# Altium schematic sheet TPS5530RTE_Schematic.SchDoc
size A
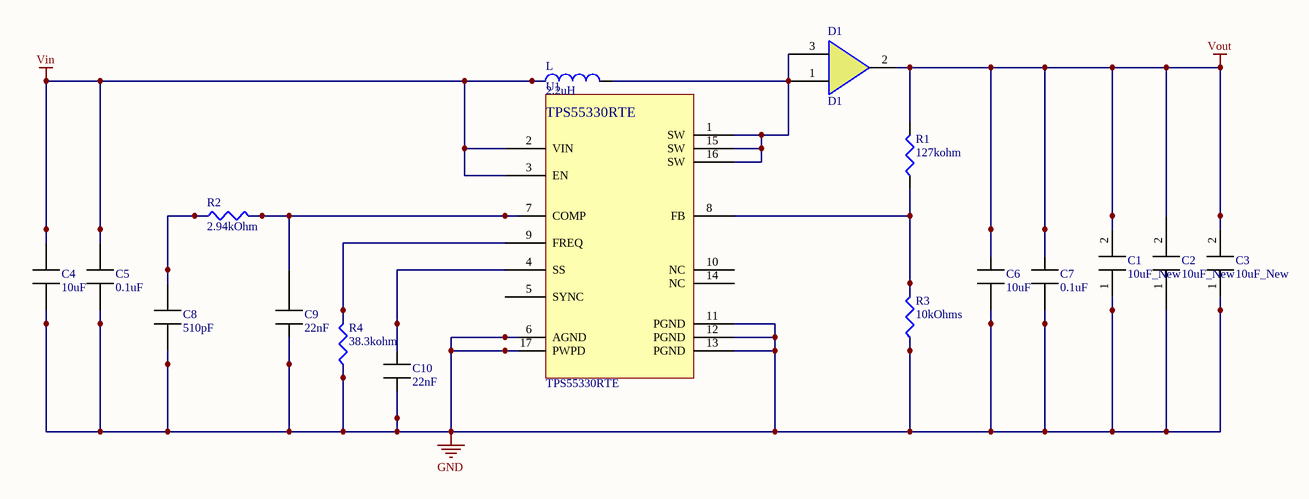
[diagram p0: TPS5530RTE_Schematic.SchDoc]

## Parts
C1  10uF_New  [CAPPM7343X310N]
C2  10uF_New  [CAPPM7343X310N]
C3  10uF_New  [CAPPM7343X310N]
C4  10uF  [C/R1206]
C5  0.1uF  [C/R0402]
C6  10uF  [C/R0805]
C7  0.1uF  [C/R0402]
C8  510pF  [C/R0402]
C9  22nF  [C/R0805]
C10  22nF  [C/R0805]
D1  D1  [D1]
L  2.2uH  [L1]
R1  127kohm  [C/R0805]
R2  2.94kOhm  [C/R0805]
R3  10kOhms  [C/R0805]
R4  38.3kohm  [C/R0805]
U1  TPS55330RTE  [TPS55330]

## Nets
GND: C1.1 C2.1 C3.1 C4.2 C5.2 C6.2 C7.1 C8.2 C9.1 C10.1 R3.1 R4.1 U1.6(AGND) U1.11(PGND) U1.12(PGND) U1.13(PGND) U1.17(PWPD)
Vin: C4.1 C5.1 L.1 U1.2(VIN) U1.3(EN)
Vout: C1.2 C2.2 C3.2 C6.1 C7.2 D1.2 R1.2
NetC8_1: C8.1 R2.1
NetC9_2: C9.2 R2.2 U1.7(COMP)
NetC10_2: C10.2 U1.4(SS)
NetD1_1: D1.1 D1.3 L.2 U1.1(SW) U1.15(SW) U1.16(SW)
NetR1_1: R1.1 R3.2 U1.8(FB)
NetR4_2: R4.2 U1.9(FREQ)

Not connected (* = marked no-connect by the designer): U1 5(SYNC) 10(NC) 14(NC)

## Library data of the parts
C1-C3 = T495D106M035ATE125: CAP TANT 10UF 35V 20% 2917; Manufacturer: KEMET; Product Range: KEMET - T495 Series; Capacitance: 10µF; Capacitor Case Style: 2917 ^7343 Metric]; ESR: 0.125ohm; Supplier 1: Digi-Key; Manufacturer Part Number: T495D106M035ATE125; Stock 1: 5675; Pricing 1: 1=1.79, 10=1.449, 100=1.1066 (USD); Packaging: Full Reel; Capacitance Tolerance: ± 20%; Voltage Rating: 35V; Operating Temperature Max: 125°C; Operating Temperature Min: -55°C; ComponentLink1URL: https://www.verical.com/server-webapp/html/getDatasheet?partID=44813&src-supplier=Verical; ComponentLink1Description: https://www.verical.com/server-webapp/html/getDatasheet?partID=44813&src-supplier=Verical; ComponentLink2URL: http://www.farnell.com/datasheets/1761160.pdf?src-supplier=Element14; ComponentLink2Description: http://www.farnell.com/datasheets/1761160.pdf?src-supplier=Element14; ComponentLink3URL: http://www.farnell.com/datasheets/1744560.pdf?src-supplier=Element14; ComponentLink3Description: http://www.farnell.com/datasheets/1744560.pdf?src-supplier=Element14
C4 = GRM31CR61C106KA88L: Cap Ceramic 10uF 16V X5R 10% SMD 1206 85C T/R; Manufacturer: Murata; Capacitance: 10000000 pF; Supplier 1: Digi-Key; Manufacturer Part Number: GRM31CR61C106KA88L; Stock 1: 45; Pricing 1: 1=0.37, 10=0.259 (USD); Case Size/Dimension: 1206; Dielectric: X5R; Tolerance (%): ±10 %; Rated Voltage: 16 V; ComponentLink1URL: http://psearch.murata.com/capacitor/product/GRM31CR61C106KA88%23.pdf?src-supplier=Avnet+Europe; ComponentLink1Description: http://psearch.murata.com/capacitor/product/GRM31CR61C106KA88%23.pdf?src-supplier=Avnet+Europe; ComponentLink2URL: https://www.murata.com/~/media/webrenewal/support/library/catalog/products/capacitor/mlcc/c02e.ashx?la=en-us&src-supplier=Digi-Key; ComponentLink2Description: https://www.murata.com/~/media/webrenewal/support/library/catalog/products/capacitor/mlcc/c02e.ashx?la=en-us&src-supplier=Digi-Key; ComponentLink3URL: http://search.murata.co.jp/Ceramy/image/img/A01X/partnumbering_e_01.pdf?src-supplier=Digi-Key; ComponentLink3Description: http://search.murata.co.jp/Ceramy/image/img/A01X/partnumbering_e_01.pdf?src-supplier=Digi-Key; ComponentLink4URL: http://psearch.murata.com/capacitor/product/GRM31CR61A476ME15%23.pdf?src-supplier=Future+Electronics; ComponentLink4Description: http://psearch.murata.com/capacitor/product/GRM31CR61A476ME15%23.pdf?src-supplier=Future+Electronics; ComponentLink5URL: https://www.distrelec.biz/Web/Downloads/_t/ds/murata_MLCC_eng_tds.pdf?mime=application%2Fpdf&src-supplier=Distrelec; ComponentLink5Description: https://www.distrelec.biz/Web/Downloads/_t/ds/murata_MLCC_eng_tds.pdf?mime=application%2Fpdf&src-supplier=Distrelec; ComponentLink6URL: http://www.farnell.com/datasheets/608985.pdf?src-supplier=Element14; ComponentLink6Description: http://www.farnell.com/datasheets/608985.pdf?src-supplier=Element14; ComponentLink7URL: http://psearch.en.murata.com/capacitor/product/GRM31CR61C106KA88%23.pdf?src-supplier=Avnet; ComponentLink7Description: http://psearch.en.murata.com/capacitor/product/GRM31CR61C106KA88%23.pdf?src-supplier=Avnet
C5 C7 = GRM155R71C104KA88D: CAP CER 0.1UF 16V X7R 0402; Manufacturer: Murata; Capacitance: 0.1 µF; Tolerance (%): ±10 %; Supplier 1: Digi-Key; Manufacturer Part Number: GRM155R71C104KA88D; Stock 1: 143464293; Pricing 1: 1=0.1, 10=0.034, 100=0.0152, 500=0.0109, 1000=0.0086, 2500=0.0078, 5000=0.0072 (USD); Case Size/Dimension: 0402; Dielectric: X7R; Rated Voltage: 16 V; ComponentLink1URL: http://www.farnell.com/datasheets/4360.pdf?src-supplier=Element14; ComponentLink1Description: http://www.farnell.com/datasheets/4360.pdf?src-supplier=Element14; ComponentLink2URL: https://www.distrelec.biz/Web/Downloads/_t/ds/murata_MLCC_eng_tds.pdf?mime=application%2Fpdf&src-supplier=Distrelec; ComponentLink2Description: https://www.distrelec.biz/Web/Downloads/_t/ds/murata_MLCC_eng_tds.pdf?mime=application%2Fpdf&src-supplier=Distrelec; ComponentLink3URL: http://psearch.murata.com/capacitor/product/GRM155R71C103KA01%23.pdf?src-supplier=Future+Electronics; ComponentLink3Description: http://psearch.murata.com/capacitor/product/GRM155R71C103KA01%23.pdf?src-supplier=Future+Electronics; ComponentLink4URL: https://www.verical.com/server-webapp/html/getDatasheet?partID=85307&src-supplier=Verical; ComponentLink4Description: https://www.verical.com/server-webapp/html/getDatasheet?partID=85307&src-supplier=Verical; ComponentLink5URL: https://www.murata.com/~/media/webrenewal/support/library/catalog/products/capacitor/mlcc/c02e.ashx?la=en-us&src-supplier=Digi-Key; ComponentLink5Description: https://www.murata.com/~/media/webrenewal/support/library/catalog/products/capacitor/mlcc/c02e.ashx?la=en-us&src-supplier=Digi-Key; ComponentLink6URL: https://produktinfo.conrad.com/datenblaetter/450000-474999/454098-da-01-en-VS_KONDENSATOR_0402.pdf?src-supplier=Conrad; ComponentLink6Description: https://produktinfo.conrad.com/datenblaetter/450000-474999/454098-da-01-en-VS_KONDENSATOR_0402.pdf?src-supplier=Conrad
C6 = CGA6P3X7S1H106K250AB: TDK - CGA6P3X7S1H106K250AB - CAP, 10µF, 50V, 10%, X7S, 1210; PCN Part Number: MLCC Part Number Change 30/Nov/2012; Product Training Modules: CGA Series for Automotive Applications SEAT, CCV, and TVCL Design Tools Guide to Replacing an Electrolytic Capacitor with an MLCC; Featured Product: CGA Series MLCC Capacitors; Online Catalog: CGA Series, Automotive General, Mid and High Voltage; Kits: 445-9005-KIT-ND  - KIT CAP CER AUTO 6.3V-50V SMD SAMPLE KIT 1005-ND  - KIT CAP CER AUTO 6.3V-50V; Other Names: 445-7004-1; Supplier 1: Digi-Key; Manufacturer: TDK; Manufacturer Part Number: CGA6P3X7S1H106K250AB; Stock 1: 318964; Pricing 1: 1=1.03, 10=0.785, 100=0.5615, 500=0.4347 (USD); RoHS Information: RoHS Certificate-MLCC; Standard Package: 1; Category: Capacitors; Family: Ceramic Capacitors; Series: CGA; Packaging: Cut Tape (CT); Capacitance: 10µF; Tolerance: ±10%; Voltage - Rated: 50V; Temperature Coefficient: X7S; Mounting Type: Surface Mount, MLCC; Operating Temperature: -55°C ~ 125°C; Applications: Automotive; Ratings: AEC-Q200; Package / Case: 1210 (3225 Metric); Size / Dimension: 0.126" L x 0.098" W (3.20mm x 2.50mm); Height - Seated (Max): -; Thickness (Max): 0.110" (2.80mm); Lead Spacing: -; Features: -; Lead Style: -; ComponentLink1URL: http://www.farnell.com/datasheets/1807242.pdf?src-supplier=Element14; ComponentLink1Description: http://www.farnell.com/datasheets/1807242.pdf?src-supplier=Element14; ComponentLink2URL: http://www.mouser.com/ds/2/400/lcc_automotive_general_en-843974.pdf?src-supplier=Mouser; ComponentLink2Description: http://www.mouser.com/ds/2/400/lcc_automotive_general_en-843974.pdf?src-supplier=Mouser
C8 = GRM1555C1H511GA01D: Cap Ceramic 510pF 50V C0G 2% SMD 0402 125C Paper T/R; Manufacturer: Murata; Dielectric: C0G (NP0); Brand: Murata Electronics; Case Height: 0.5 mm; Case Length: 1 mm; Type: General Purpose MLCC; Supplier 1: Digi-Key; Manufacturer Part Number: GRM1555C1H511GA01D; Stock 1: 21664; Pricing 1: 1=0.19, 10=0.131, 100=0.0664, 500=0.0454, 1000=0.0402, 2500=0.0385, 5000=0.035 (USD); Product Category: Multilayer Ceramic Capacitors MLCC - SMD/SMT; RoHS: Details; Capacitance: 510 pF; Voltage Rating DC: 50 V; Tolerance: 2 %; Case Code - in: 0402; Case Code - mm: 1005; Minimum Operating Temperature: - 55 C; Maximum Operating Temperature: + 125 C; Termination Style: SMD/SMT; Product: General Type MLCCs; Case Width: 0.5 mm; Package / Case: 0402 (1005 metric); Packaging: Reel; Series: GRM; Factory Pack Quantity: 10000; ComponentLink1URL: https://www.murata.com/~/media/webrenewal/support/library/catalog/products/capacitor/mlcc/c02e.ashx?la=en-us&src-supplier=Digi-Key; ComponentLink1Description: https://www.murata.com/~/media/webrenewal/support/library/catalog/products/capacitor/mlcc/c02e.ashx?la=en-us&src-supplier=Digi-Key
C9 = CGA4J2C0G1H223J125AA: TDK - CGA4J2C0G1H223J125AA - KONDENSATOR 0.022µF 50V 5% C0G/NP0 0805; PCN Part Number: MLCC Part Number Change 30/Nov/2012; Product Training Modules: CGA Series for Automotive Applications SEAT, CCV, and TVCL Design Tools Guide to Replacing an Electrolytic Capacitor with an MLCC; Featured Product: CGA Series MLCC Capacitors; Temperature Coefficient: C0G, NP0; Online Catalog: CGA Series, Automotive General, Mid and High Voltage; Other Names: 445-6949-6; Supplier 1: Newark; Manufacturer: TDK; Manufacturer Part Number: CGA4J2C0G1H223J125AA; Stock 1: 19725; Pricing 1: 5=0.594, 10=0.351, 25=0.305, 50=0.259, 100=0.213, 250=0.194, 500=0.175, 1000=0.152 (USD); RoHS Information: RoHS Certificate-MLCC; Standard Package: 1; Category: Capacitors; Family: Ceramic Capacitors; Series: CGA; Packaging: Digi-Reel®; Capacitance: 0.022µF; Tolerance: ±5%; Voltage - Rated: 50V; Mounting Type: Surface Mount, MLCC; Operating Temperature: -55°C ~ 125°C; Applications: Automotive; Ratings: AEC-Q200; Package / Case: 0805 (2012 Metric); Size / Dimension: 0.079" L x 0.049" W (2.00mm x 1.25mm); Height - Seated (Max): -; Thickness (Max): 0.057" (1.45mm); Lead Spacing: -; Features: -; Lead Style: -; ComponentLink1URL: http://www.mouser.com/ds/2/400/lcc_automotive_general_en-843974.pdf?src-supplier=Mouser; ComponentLink1Description: http://www.mouser.com/ds/2/400/lcc_automotive_general_en-843974.pdf?src-supplier=Mouser
C10 = C0805C223K5RAC: KEMET 22nF Multilayer Ceramic Capacitor (MLCC) 50V dc 10% X7R dielectric max op. temp. 125C; Construction form: 0805; Rated voltage: 50VDC; Supplier 1: Mouser; Manufacturer: KEMET; Manufacturer Part Number: C0805C223K5RAC; Stock 1: 133849; Pricing 1: 1=0.1, 10=0.024, 100=0.016, 500=0.014, 1000=0.011, 4000=0.008 (USD); Capacitance: 22nF; Capacitance tolerance: ±10%; Ceramic type: X7R; Temperature range: -55...+125°C; ComponentLink1URL: http://www.mouser.com/ds/2/212/KEM_C1002_X7R_SMD-1102033.pdf?src-supplier=Mouser; ComponentLink1Description: http://www.mouser.com/ds/2/212/KEM_C1002_X7R_SMD-1102033.pdf?src-supplier=Mouser; ComponentLink2URL: https://www1.elfa.se/data1/wwwroot/assets/datasheets/slCeramic-Chip-Condensers_e.pdf?src-supplier=Distrelec; ComponentLink2Description: https://www1.elfa.se/data1/wwwroot/assets/datasheets/slCeramic-Chip-Condensers_e.pdf?src-supplier=Distrelec
D1 = PDS760-13: DIODE SCHOTTKY 60V 7A POWERDI5; Manufacturer: Diodes; Vf - Forward Voltage: 0.62 V; Ifsm - Forward Surge Current: 275 A; Configuration: Single Dual Anode; Ir - Reverse Current: 200 uA; Brand: Diodes Incorporated; Type: Schottky Diode; Unit Weight: 0.003386 oz; Supplier 1: Digi-Key; Manufacturer Part Number: PDS760-13; Stock 1: 80872; Pricing 1: 1=1.54, 10=1.381, 100=1.0764, 500=0.8892, 1000=0.702 (USD); Product Category: Schottky Diodes & Rectifiers; RoHS: True; Product: Schottky Diodes; Mounting Style: SMD/SMT; Package / Case: POWERDI-5; If - Forward Current: 7 A; Vrrm - Repetitive Reverse Voltage: 60 V; Technology: Si; Maximum Operating Temperature: + 150 C; Minimum Operating Temperature: - 65 C; Series: PDS560; Packaging: Reel; Height: 1.15 mm; Length: 4.05 mm; Operating Temperature Range: - 65 C to + 150 C; Factory Pack Quantity: 5000; Width: 5.45 mm; ComponentLink1URL: https://www.diodes.com/assets/Datasheets/ds30477.pdf?src-supplier=Digi-Key; ComponentLink1Description: https://www.diodes.com/assets/Datasheets/ds30477.pdf?src-supplier=Digi-Key; ComponentLink2URL: http://www.mouser.com/ds/2/115/ds30477-62081.pdf?src-supplier=Mouser; ComponentLink2Description: http://www.mouser.com/ds/2/115/ds30477-62081.pdf?src-supplier=Mouser; ComponentLink3URL: http://www.farnell.com/datasheets/1915491.pdf?src-supplier=Element14; ComponentLink3Description: http://www.farnell.com/datasheets/1915491.pdf?src-supplier=Element14; ComponentLink4URL: http://www.diodes.com/datasheets/ds30477.pdf?src-supplier=Avnet; ComponentLink4Description: http://www.diodes.com/datasheets/ds30477.pdf?src-supplier=Avnet; ComponentLink5URL: http://www.diodes.com/datasheets/ds30477.pdf?src-supplier=Future+Electronics; ComponentLink5Description: http://www.diodes.com/datasheets/ds30477.pdf?src-supplier=Future+Electronics; ComponentLink6URL: http://www.diodes.com/datasheets/ds30477.pdf?src-supplier=Avnet+Europe; ComponentLink6Description: http://www.diodes.com/datasheets/ds30477.pdf?src-supplier=Avnet+Europe
L = IHLP2525EZER2R2M01: Fixed Inductors 2.2uH 20%; Manufacturer: Vishay Dale; Maximum DC Current: 10 A; Maximum DC Resistance: 13.6 mOhms; Shielding: Shielded; Brand: Vishay / Dale; Self Resonant Frequency: 1 MHz; Test Frequency: 100 kHz; Supplier 1: Digi-Key; Manufacturer Part Number: IHLP2525EZER2R2M01; Stock 1: 2918; Pricing 1: 1=3.11, 10=2.846, 100=1.863 (USD); Product Category: Fixed Inductors; RoHS: True; Inductance: 2.2 uH; Tolerance: 20 %; Operating Temperature Range: - 55 C to + 125 C; Termination Style: SMD/SMT; Package / Case: 2525 (6363 metric); Length: 6.86 mm; Width: 6.47 mm; Height: 5 mm; Series: IHLP-2525EZ-01; Mounting Style: Solder Pad; Packaging: Reel; Product: Power Inductors; Factory Pack Quantity: 500; Type: Low Profile High Current IHLP Inductors; ComponentLink1URL: http://uk.rs-online.com/webdocs/102c/0900766b8102c936.pdf?src-supplier=RSComponents; ComponentLink1Description: http://uk.rs-online.com/webdocs/102c/0900766b8102c936.pdf?src-supplier=RSComponents; ComponentLink2URL: http://www.mouser.com/ds/2/427/ihlp-2525ez-01-221830.pdf?src-supplier=Mouser; ComponentLink2Description: http://www.mouser.com/ds/2/427/ihlp-2525ez-01-221830.pdf?src-supplier=Mouser; ComponentLink3URL: http://www.farnell.com/datasheets/2047080.pdf?src-supplier=Element14; ComponentLink3Description: http://www.farnell.com/datasheets/2047080.pdf?src-supplier=Element14
R1 = ERA-6AEB1273V: RES SMD 127K OHM 0.1% 1/8W 0805; Manufacturer: Panasonic; Product Range: PANASONIC - ERA Series Metal Film Chip Resistor; Power Rating: 125mW; Resistor Case Style: 0805 [2012 Metric]; Resistor Element Material: Thin Film; Temperature Coefficient: ± 25ppm/°C; Voltage Rating: 100V; External Depth: 1.25mm; External Length / Height: 0.5mm; External Width: 2mm; No. of Pins: 2; Supplier 1: Digi-Key; Manufacturer Part Number: ERA-6AEB1273V; Stock 1: 14724; Pricing 1: 1=0.36, 10=0.302, 100=0.1182, 1000=0.0495, 2500=0.0454 (USD); Resistance: 127kohm; Resistance Tolerance: ± 0.1%; Operating Temperature Max: 155°C; Operating Temperature Min: -55°C; Operating Temperature Range: -55°C to +155°C; Packaging: Reel; Resistor Mounting: SMD; Series: ERA; ComponentLink1URL: http://www.farnell.com/datasheets/485442.pdf?src-supplier=Farnell; ComponentLink1Description: http://www.farnell.com/datasheets/485442.pdf?src-supplier=Farnell; ComponentLink2URL: http://industrial.panasonic.com/www-data/pdf/AOA0000/AOA0000CE26.pdf?src-supplier=Avnet; ComponentLink2Description: http://industrial.panasonic.com/www-data/pdf/AOA0000/AOA0000CE26.pdf?src-supplier=Avnet; ComponentLink3URL: http://www.farnell.com/datasheets/485442.pdf?src-supplier=Element14; ComponentLink3Description: http://www.farnell.com/datasheets/485442.pdf?src-supplier=Element14; ComponentLink4URL: http://uk.rs-online.com/webdocs/0eb1/0900766b80eb1d8c.pdf?src-supplier=RSComponents; ComponentLink4Description: http://uk.rs-online.com/webdocs/0eb1/0900766b80eb1d8c.pdf?src-supplier=RSComponents; ComponentLink5URL: http://www.produktinfo.conrad.com/datenblaetter/1100000-1199999/001181360-da-01-en-WIDERSTAND_ERA_0805_127K_0_1__5000ST.pdf?src-supplier=Conrad; ComponentLink5Description: http://www.produktinfo.conrad.com/datenblaetter/1100000-1199999/001181360-da-01-en-WIDERSTAND_ERA_0805_127K_0_1__5000ST.pdf?src-supplier=Conrad
R2 = ERA-6AEB2941V: RES SMD 2.94K OHM 0.1% 1/8W 0805; Manufacturer: Panasonic; Product Range: PANASONIC - ERA Series; Power Rating: 125mW; Resistor Case Style: 0805 [2012 Metric]; Resistor Element Material: Thin Film; Temperature Coefficient: ± 25ppm/°C; Voltage Rating: 100V; External Depth: 1.25mm; External Length / Height: 0.5mm; External Width: 2mm; No. of Pins: 2; Supplier 1: Digi-Key; Manufacturer Part Number: ERA-6AEB2941V; Stock 1: 28336; Pricing 1: 1=0.36, 10=0.302, 100=0.1182, 1000=0.0495, 2500=0.0454 (USD); Resistance: 2.94kohm; Resistance Tolerance: ± 0.1%; Packaging: Reel; Operating Temperature Max: 155°C; Operating Temperature Min: -55°C; Operating Temperature Range: -55°C to +155°C; Resistor Mounting: SMD; Series: ERA; ComponentLink1URL: http://uk.rs-online.com/webdocs/0eb1/0900766b80eb1d8c.pdf?src-supplier=RSComponents; ComponentLink1Description: http://uk.rs-online.com/webdocs/0eb1/0900766b80eb1d8c.pdf?src-supplier=RSComponents; ComponentLink2URL: http://www.farnell.com/datasheets/485442.pdf?src-supplier=Farnell; ComponentLink2Description: http://www.farnell.com/datasheets/485442.pdf?src-supplier=Farnell; ComponentLink3URL: http://industrial.panasonic.com/www-data/pdf/AOA0000/AOA0000CE26.pdf?src-supplier=Avnet; ComponentLink3Description: http://industrial.panasonic.com/www-data/pdf/AOA0000/AOA0000CE26.pdf?src-supplier=Avnet; ComponentLink4URL: http://www.farnell.com/datasheets/485442.pdf?src-supplier=Element14; ComponentLink4Description: http://www.farnell.com/datasheets/485442.pdf?src-supplier=Element14; ComponentLink5URL: http://industrial.panasonic.com/www-data/pdf/AOA0000/AOA0000CE26.pdf?src-supplier=Avnet+Europe; ComponentLink5Description: http://industrial.panasonic.com/www-data/pdf/AOA0000/AOA0000CE26.pdf?src-supplier=Avnet+Europe; ComponentLink6URL: http://www.mouser.com/ds/2/315/AOA0000C237-1100991.pdf?src-supplier=Mouser; ComponentLink6Description: http://www.mouser.com/ds/2/315/AOA0000C237-1100991.pdf?src-supplier=Mouser; ComponentLink7URL: http://www.produktinfo.conrad.com/datenblaetter/1100000-1199999/001181273-da-01-en-WIDERSTAND_ERA_0805_2K94_0_1__5000ST.pdf?src-supplier=Conrad; ComponentLink7Description: http://www.produktinfo.conrad.com/datenblaetter/1100000-1199999/001181273-da-01-en-WIDERSTAND_ERA_0805_2K94_0_1__5000ST.pdf?src-supplier=Conrad
R3 = CRCW080510K0FKEC: Res Thick Film 0805 10K Ohm 1% 0.125W(1/8W) ±100ppm/C Molded SMD Automotive Paper T/R; Manufacturer: Vishay Dale; Power (Watts): 0.125W, 1/8W; Temperature Coefficient: ±100ppm/°C; Supplier 1: Digi-Key; Manufacturer Part Number: CRCW080510K0FKEC; Stock 1: 19837; Pricing 1: 1=0.1, 10=0.066, 100=0.0267, 1000=0.012, 2500=0.0104, 5000=0.0086 (USD); Category: Resistors; Family: Chip Resistor - Surface Mount; Series: CRCW; Packaging: Tape & Reel (TR); Part Status: Active; Resistance (Ohms): 10k; Tolerance: ±1%; Composition: Thick Film; Features: Automotive AEC-Q200; Operating Temperature: -55°C ~ 155°C; Package / Case: 0805 (2012 Metric); Supplier Device Package: 0805; Size / Dimension: 0.079" L x 0.049" W (2.00mm x 1.25mm); Height: 0.020" (0.50mm); Number of Terminations: 2; Failure Rate: -; ComponentLink1URL: http://www.vishay.com/docs/20035/dcrcwe3.pdf?src-supplier=Avnet; ComponentLink1Description: http://www.vishay.com/docs/20035/dcrcwe3.pdf?src-supplier=Avnet
R4 = ERA-6AEB3832V: RES SMD 38.3K OHM 0.1% 1/8W 0805; Manufacturer: Panasonic; Power Rating: 125mW; Resistor Case Style: 0805 [2012 Metric]; Resistor Element Material: Thin Film; Temperature Coefficient: ± 25ppm/°C; Voltage Rating: 100V; External Depth: 1.25mm; External Length / Height: 0.5mm; External Width: 2mm; No. of Pins: 2; Product Range: PANASONIC - ERA; Supplier 1: Digi-Key; Manufacturer Part Number: ERA-6AEB3832V; Stock 1: 22091; Pricing 1: 1=0.36, 10=0.302, 100=0.1182, 1000=0.0495, 2500=0.0454 (USD); Resistance: 38.3kohm; Resistance Tolerance: ± 0.1%; Operating Temperature Max: 155°C; Operating Temperature Min: -55??C; Operating Temperature Range: -55°C to +155°C; Packaging: Reel; Resistor Mounting: SMD; Series: ERA; ComponentLink1URL: http://uk.rs-online.com/webdocs/0eb1/0900766b80eb1d8c.pdf?src-supplier=RSComponents; ComponentLink1Description: http://uk.rs-online.com/webdocs/0eb1/0900766b80eb1d8c.pdf?src-supplier=RSComponents; ComponentLink2URL: http://industrial.panasonic.com/www-data/pdf/AOA0000/AOA0000CE26.pdf?src-supplier=Avnet; ComponentLink2Description: http://industrial.panasonic.com/www-data/pdf/AOA0000/AOA0000CE26.pdf?src-supplier=Avnet; ComponentLink3URL: http://industrial.panasonic.com/www-data/pdf/AOA0000/AOA0000CE26.pdf?src-supplier=Avnet+Europe; ComponentLink3Description: http://industrial.panasonic.com/www-data/pdf/AOA0000/AOA0000CE26.pdf?src-supplier=Avnet+Europe; ComponentLink4URL: http://www.produktinfo.conrad.com/datenblaetter/1100000-1199999/001181330-da-01-en-WIDERSTAND_ERA_0805_38K3_0_1__5000ST.pdf?src-supplier=Conrad; ComponentLink4Description: http://www.produktinfo.conrad.com/datenblaetter/1100000-1199999/001181330-da-01-en-WIDERSTAND_ERA_0805_38K3_0_1__5000ST.pdf?src-supplier=Conrad
U1 = TPS55330RTE: Manufacturer: Texas Instruments; Manufacturer Part Number: TPS55330RTER; Minimum Quantity: Step-Up (Boost), Flyback, Sepic; Output Type: Adjustable; Number of Outputs: 1; Voltage - Output: 2.9 V ~ 22 V; Voltage - Input: 2.9 V ~ 16 V; PWM Type: Current Mode; Frequency - Switching: 94kHz ~ 1.14MHz; Current - Output: 5A; Synchronous Rectifier: No; Supplier 1: Digi-Key; Stock 1: 5703; Pricing 1: 1=3.12, 10=2.804, 100=2.1799, 500=1.8853, 1000=1.5672 (USD); Quantity Available: Tape & Reel (TR)Alternate Packaging; Package/Case: 16-WFQFN Exposed Pad; Standard Package: 3,000; Category: Integrated Circuits (ICs); Family: PMIC - Voltage Regulators - DC DC Switching Regulators; Packaging: Tape & Reel (TR); Type: Step-Up (Boost), Flyback, Sepic; Operating Temperature: -40°C ~ 150°C; Mounting Type: Surface Mount; Package / Case: 16-WFQFN Exposed Pad; Supplier Device Package: 16-WQFN (3x3); ComponentLink1URL: http://www.ti.com/lit/ds/symlink/tps55330.pdf?src-supplier=Digi-Key; ComponentLink1Description: http://www.ti.com/lit/ds/symlink/tps55330.pdf?src-supplier=Digi-Key; ComponentLink2URL: http://www.ti.com/lit/ds/symlink/tps55330.pdf?src-supplier=Avnet; ComponentLink2Description: http://www.ti.com/lit/ds/symlink/tps55330.pdf?src-supplier=Avnet